# EAGLE design BMP280-Breakout_v11 (EAGLE 7.5.0)
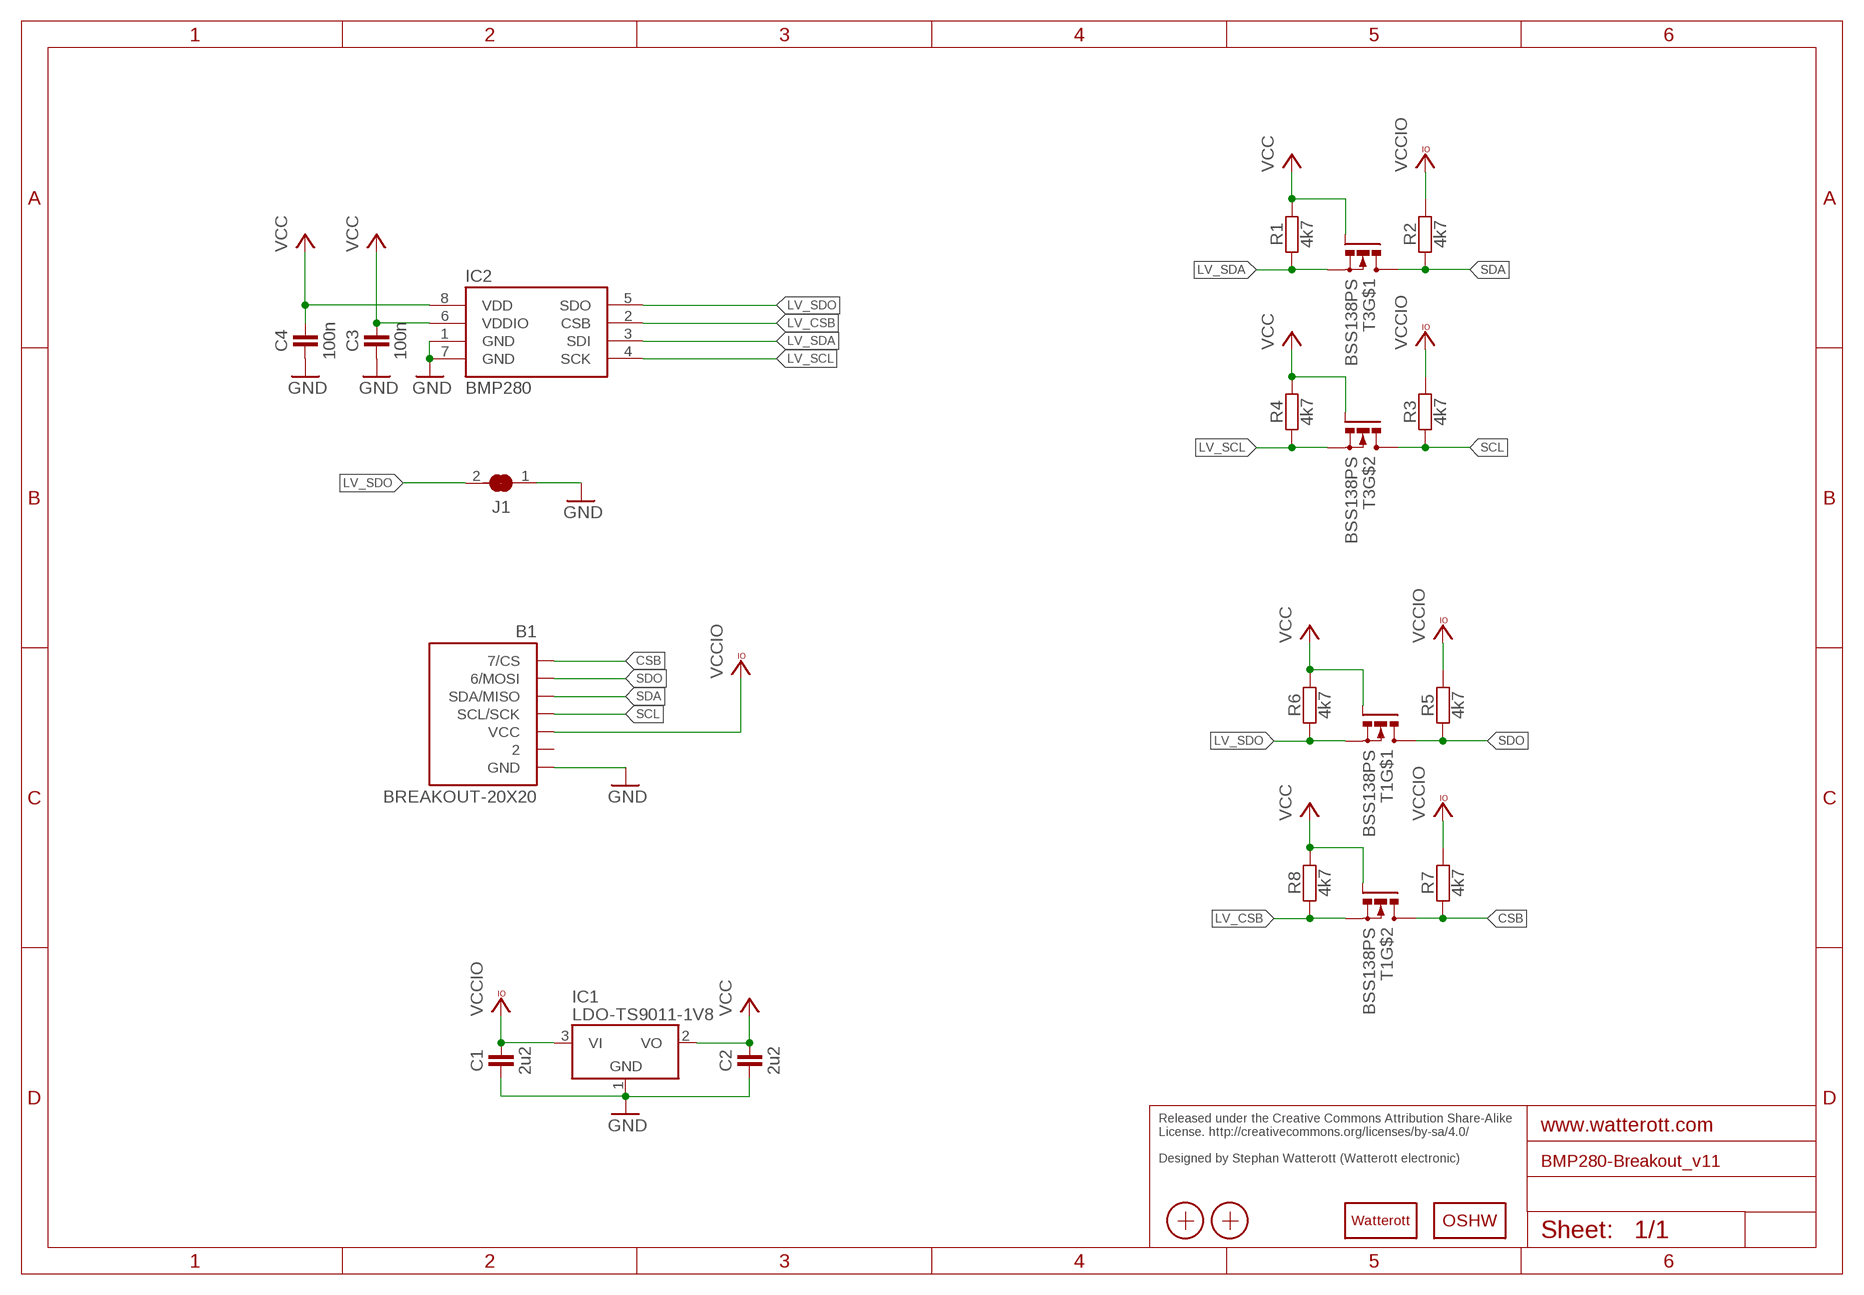
[diagram p0: schematic, sheet 1]

## Parts
B1  BREAKOUT-20X20  [BREAKOUT-20X20]
C1  2u2  CAPACITOR-C0402  [R0402]
C2  2u2  CAPACITOR-C0402  [R0402]
C3  100n  CAPACITOR-C0402  [R0402]
C4  100n  CAPACITOR-C0402  [R0402]
IC1  LDO-TS9011-1V8  LDO-TS9011-3V3  [SOT23]
IC2  BMP280  [LGA]
J1  JUMPER2  [JUMPER2]
LOGO1  LOGO-S_PLACE_M  [SPARK_TPLACE_M]
LOGO2  OSHW_LOGOX0070  [OSHW_6X70]
R1  4k7  RESISTOR-R0402  [R0402]
R2  4k7  RESISTOR-R0402  [R0402]
R3  4k7  RESISTOR-R0402  [R0402]
R4  4k7  RESISTOR-R0402  [R0402]
R5  4k7  RESISTOR-R0402  [R0402]
R6  4k7  RESISTOR-R0402  [R0402]
R7  4k7  RESISTOR-R0402  [R0402]
R8  4k7  RESISTOR-R0402  [R0402]
T1  BSS138PS  [SOT363]
T3  BSS138PS  [SOT363]
X1  PASSER-07  [PASSER_07MM]
X2  PASSER-07  [PASSER_07MM]

## Nets
CSB: B1.CS(7/CS) R7.1 T1.3(D)
GND: B1.GND C1.1 C2.1 C3.1 C4.1 IC1.1(GND) IC2.1(GND) IC2.7(GND) J1.1
LV_CSB: IC2.2(CSB) R8.1 T1.4(S)
LV_SCL: IC2.4(SCK) R4.1 T3.4(S)
LV_SDA: IC2.3(SDI) R1.1 T3.1(S)
LV_SDO: IC2.5(SDO) J1.2 R6.1 T1.1(S)
SCL: B1.SCL/SCK R3.1 T3.3(D)
SDA: B1.SDA/MISO R2.1 T3.6(D)
SDO: B1.MOSI(6/MOSI) R5.1 T1.6(D)
VCC: C2.2 C3.2 C4.2 IC1.2(VO) IC2.6(VDDIO) IC2.8(VDD) R1.2 R4.2 R6.2 R8.2 T1.2(G) T1.5(G) T3.2(G) T3.5(G)
VCCIO: B1.VCC C1.2 IC1.3(VI) R2.2 R3.2 R5.2 R7.2
Unconnected: B1.2

## Notes on the sheet
- Released under the Creative Commons Attribution Share-Alike 
  License. http://creativecommons.org/licenses/by-sa/4.0/
  
  Designed by Stephan Watterott (Watterott electronic)

## Library data of the parts
B1 = we-board:BREAKOUT: Breakout Template
C1-C4 = we-rcl:CAPACITOR: Capacitors ...4.7uF @ 6.3V -> 0402 ...10uF @ 16V -> 0603 ...22uF @ 25V -> 0805
IC1 = we-power:LDO: LDOs TS1117 800mA, Vin max 12V TS9011 250mA, Vin max 12V - compatible AP2210 300mA, Vin max 15V TS5204 150mA, Vin max 16V
IC2 = we-sensor:BMP280: BOSCH BMP280 Digital Pressure Sensor
J1 = we-rcl:JUMPER2
LOGO1 = we-symbol:LOGO: Watterott electronic Logo
LOGO2 = we-symbol:OSHW_LOGO: Open-Source-Hardware Logo
R1-R8 = we-rcl:RESISTOR: Resistors all kinds in 0603 and 0402
T1 T3 = we-transistor:BSS138PS
X1 X2 = we-symbol:PASSER: Fiducial Markers

## Board
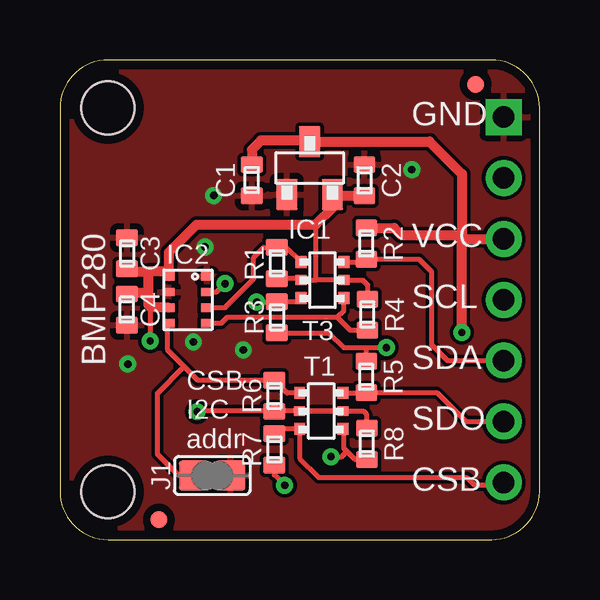
[diagram p1: board, top side]
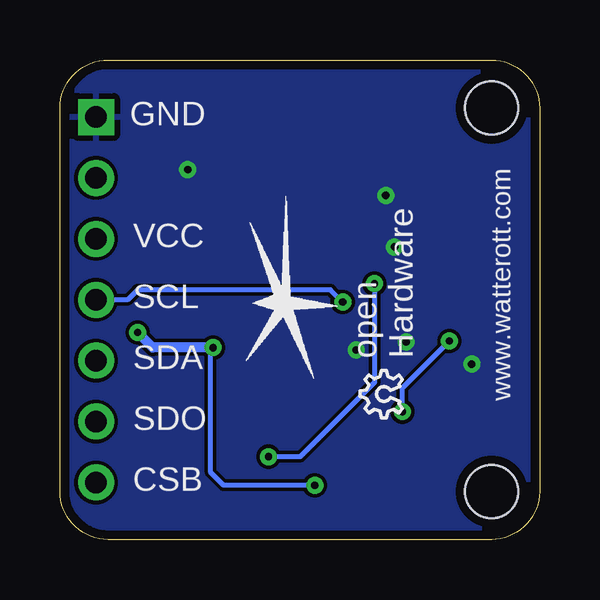
[diagram p2: board, bottom side, seen from below]

Size 20 x 20 mm. Coordinates in mm from the lower left corner, seen from the top.
Copper layers (1*16): Top 0.035mm / dielectric 1.5mm / Bottom 0.035mm
Design rules "default *": minimum track width 6mil, minimum drill 0.296mm, track to track 6mil, track to pad 6mil, pad to pad 6mil, via to via 6mil, smd to smd 1mil, copper to edge 15mil, drill to drill 8mil, minimum pad ring 10mil, minimum via ring 8mil, stop-mask expansion 4mil, vias tented up to drill 0.7mm, thermal gap 10mil
Holes 2.2 mm at 2,18 2,2

### Footprints (pad centres in the part's own frame; a part is rotated, then mirrored left to right if it is on the bottom)
BREAKOUT-20X20 = drill 0.9 pad 1.5: 2 18.5,15.08; CS 18.5,2.38; MOSI 18.5,4.92; SCL/SCK 18.5,10; SDA/MISO 18.5,7.46; VCC 18.5,12.54 | drill 0.9 pad 1.5 square: GND 18.5,17.62 | hole 2.2: 2,18; 2,2
R0402 = smd 0.9 x 0.7: 1 0,0.65; 2 0,-0.65
SOT23 = smd 1.3 x 0.9: 1 -1.1,0.95; 2 -1.1,-0.95; 3 1.1,0
LGA = smd 0.5 x 0.35: 1 0.8,0.975; 2 0.8,0.325; 3 0.8,-0.325; 4 0.8,-0.975; 5 -0.8,-0.975; 6 -0.8,-0.325; 7 -0.8,0.325; 8 -0.8,0.975
JUMPER2 = smd 1.25 x 1.25: 1 0,0.76; 2 0,-0.76
SOT363 = smd 0.5 x 0.5: 1 -0.9,0.75; 3 -0.9,-0.75; 4 0.9,-0.75; 6 0.9,0.75 | smd 0.5 x 0.4: 2 -0.9,0; 5 0.9,0
PASSER_07MM = smd 0.7 x 0.7: X 0,0

### Placement (x,y rotation side)
B1  0,0 0 top
C1  8,14.99 180 top
C2  12.7,14.99 0 top
C3  2.79,11.94 0 top
C4  2.79,9.59 180 top
IC1  10.41,15.49 90 top
IC2  5.33,10 0 top
J1  6.35,2.67 270 top
LOGO1  10.67,9.91 90 bottom
LOGO2  5.71,5.08 90 bottom
R1  9.04,11.53 0 top
R2  12.78,12.34 180 top
R3  9.04,9.27 0 top
R4  12.83,9.37 180 top
R5  12.78,6.78 180 top
R6  8.94,5.99 0 top
R7  8.94,3.76 0 top
R8  12.8,3.99 180 top
T1  10.9,5.36 0 top
T3  10.95,10.82 0 top
X1  17.34,18.99 0 top
X2  4.13,0.83 0 top

### Tracks (layer width: path | path; a pad name or v marks a point on that pad's centre or on a via)
CSB
  Top 0.2: R7.1 9.14,4.61 T1.3 10,3.39 10.79,2.59 16.97,2.59 17.27,2.29 18.41,2.29 B1.CS
GND  (via drill 0.3)
  other vias: 6.05,12.2 7.65,7.91 6.41,14.35 14.67,15.43 2.83,7.32 5.56,8.24
  pour Top: -0.13,20.19 20.13,20.19 20.13,-0.13 -0.13,-0.13
  pour Bottom: -0.13,20.19 20.13,20.19 20.13,-0.13 -0.13,-0.13
LV_CSB  (via drill 0.3)
  Top 0.2: R8.1 12.31,3.34 11.96,3.68 | 11.96,3.68 11.84,3.81 11.84,4.57 T1.4 | v11.3,3.45 11.73,3.45 11.96,3.68 | IC2.2 6.54,10.32 v6.88,10.67
  Bottom 0.2: v6.88,10.67 6.88,6.55 9.98,3.45 v11.3,3.45
LV_SCL
  Top 0.2: 11.56,9.27 6.99,9.27 6.74,9.03 IC2.4 | 11.56,9.27 11.84,9.55 11.84,10.06 T3.4 | R4.1 12.11,8.72 11.56,9.27
LV_SDA
  Top 0.2: T3.1 9.44,12.18 R1.1 8.5,12.18 8.08,11.76 8.08,10.87 6.88,9.68 IC2.3
LV_SDO
  Top 0.2: 5.18,7.21 5.75,6.64 R6.1 9.48,6.11 T1.1 | 5.18,7.21 4.5,7.9 4.5,8.99 IC2.5 | J1.2 4.95,2.67 4.06,3.56 4.06,6.1 5.18,7.21
SCL  (via drill 0.3)
  Top 0.2: T3.3 9.9,9.92 R3.1 9.03,9.91 v8.2,9.91
  Bottom 0.2: v8.2,9.91 8.71,10.41 16.76,10.41 17.18,10 B1.SCL/SCK
SDA
  Top 0.2: T3.6 12.65,11.57 R2.1 14.98,11.69 15.49,11.18 15.49,8.13 16.16,7.46 B1.SDA/MISO
SDO
  Top 0.2: T1.6 12.75,6.11 R5.1 15.71,6.13 16.92,4.92 B1.MOSI
VCC  (via drill 0.3)
  Top 0.2: 10.67,10.82 T3.5 12.62,10.82 12.83,10.62 R4.2 | 10.19,10.82 T3.2 9.99,10.88 | 11.42,14.34 11.42,13.89 | 9.99,10.88 R1.2 | 9.99,10.88 10.12,10.88 10.19,10.82 | 10.19,10.82 10.67,10.82 | 10.67,10.82 10.67,13.12 10.66,13.13 | R6.2 8.96,5.36 T1.2 T1.5 | T1.5 12.65,5.36 12.78,5.23 12.78,4.66 R8.2 | T1.5 5.74,5.36 v5.71,5.33 | v3.76,8.28 3.79,8.31 3.79,9.69
  Top 0.406: IC1.2 11.42,14.34 C2.2 | C3.2 2.91,11.18 3.68,11.18 | 3.68,11.18 4.49,11.18 IC2.8 4.55,11.15 4.55,11.99 5.69,13.13 10.66,13.13 11.42,13.89 | 3.68,11.18 3.68,10.29 | 3.68,10.29 2.84,10.29 C4.2 | IC2.6 3.8,9.68 3.79,9.69 3.68,9.79 3.68,10.29
  Bottom 0.2: v5.71,5.33 5.71,6.33 v3.76,8.28
VCCIO  (via drill 0.3)
  Top 0.2: R3.2 11.22,8.62 11.84,8 12.85,8 | 12.85,8 v13.61,8 13.69,8 | R5.2 12.78,7.92 12.85,8 | R7.2 8.94,2.69 v9.37,2.26
  Top 0.406: C1.2 8,16.26 8.38,16.64 10.37,16.64 IC1.3 15.41,16.59 16.76,15.24 16.76,12.7 | R2.2 13.93,12.99 14.22,12.7 16.76,12.7 | v16.76,8.64 16.76,12.7 | 16.76,12.7 16.92,12.54 B1.VCC
  Bottom 0.2: v9.37,2.26 13.18,2.26 13.72,2.79 13.72,7.9 v13.61,8
  Bottom 0.406: v13.61,8 16.13,8 v16.76,8.64

### Text on the board
tPlace: GND | VCC | BMP280 | SCL | SDA | SDO | CSB / I2C / addr | CSB
bPlace: GND | www.watterott.com | VCC | SCL | open / Hardware | SDA | SDO | CSB